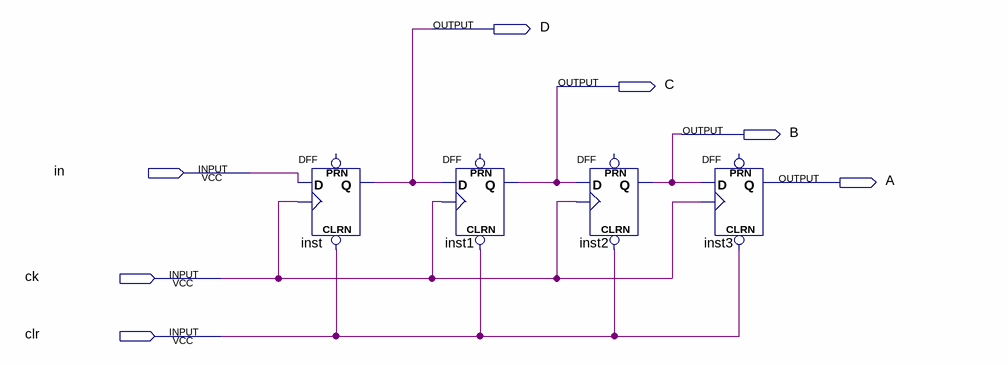
[diagram p0: schematic sheet]
// Quartus schematic lab4.bdf as structural Verilog: 4 symbols, 7 pins
module lab4 (
  input  in,
  input  ck,
  input  clr,
  output D,
  output C,
  output B,
  output A
);

  DFF inst (.CLRN(clr), .CLK(ck), .D(in), .Q(D));  // open: PRN
  DFF inst1 (.CLRN(clr), .CLK(ck), .D(D), .Q(C));  // open: PRN
  DFF inst2 (.CLRN(clr), .CLK(ck), .D(C), .Q(B));  // open: PRN
  DFF inst3 (.CLRN(clr), .CLK(ck), .D(B), .Q(A));  // open: PRN
endmodule
